# Altium schematic sheet 3.motor drivers.SchDoc
size A; DocumentNumber: 3; SheetNumber: 3; SheetTotal: 6
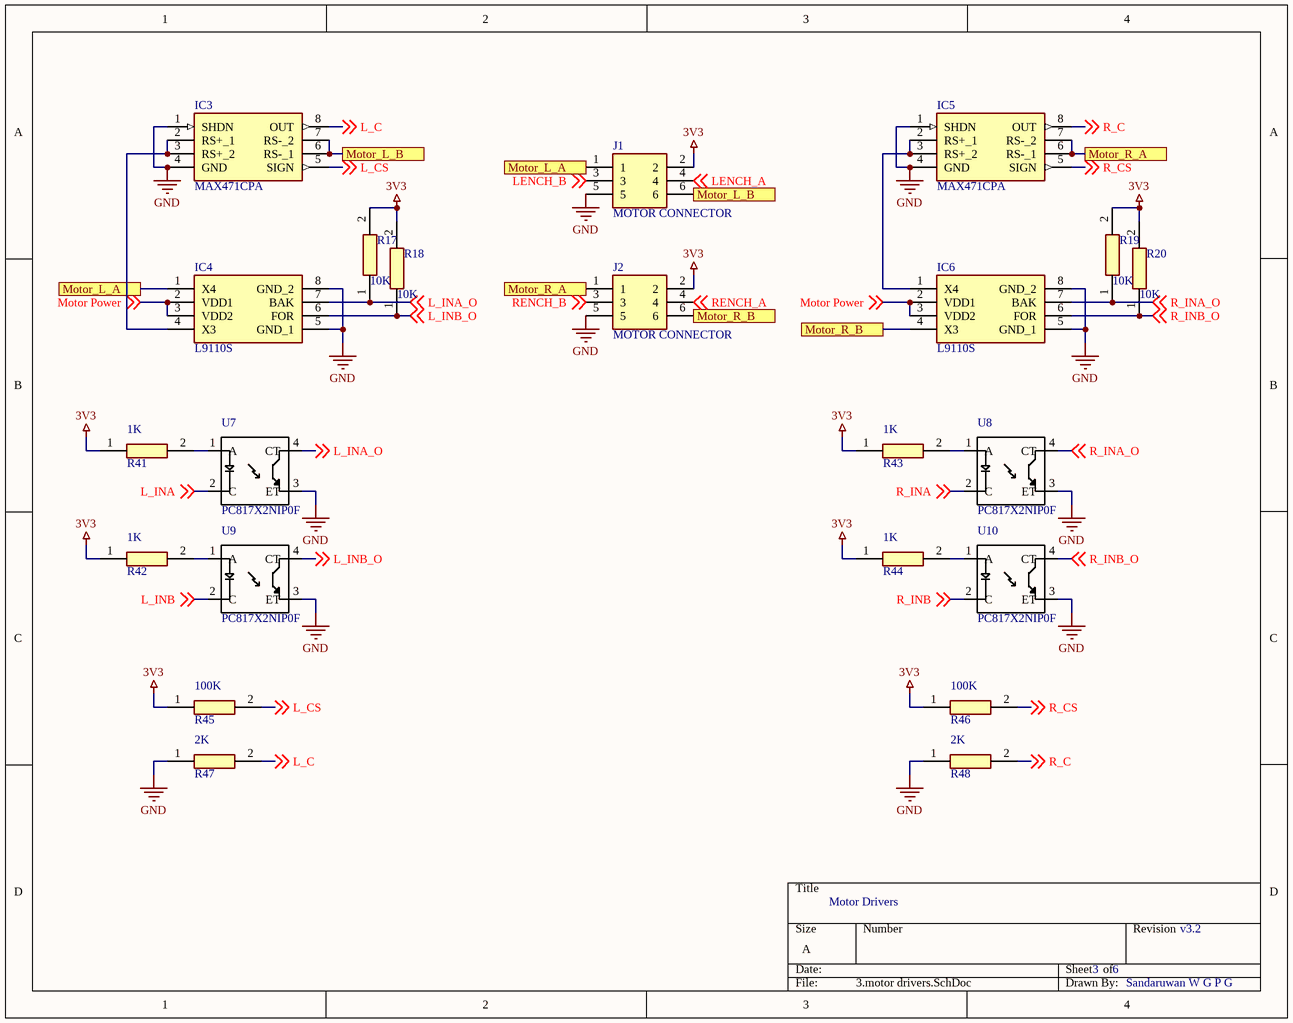
[diagram p0: 3.motor drivers.SchDoc]

## Parts
IC3  MAX471CPA  [SOIC127P600X175-8N]
IC4  L9110S  [SOIC127P600X175-8N]
IC5  MAX471CPA  [SOIC127P600X175-8N]
IC6  L9110S  [SOIC127P600X175-8N]
J1  MOTOR CONNECTOR  [533980671]
J2  MOTOR CONNECTOR  [533980671]
R17  value 10K  [RESC2012X65N]  (hidden comment: CPF0805B100KE)
R18  value 10K  [RESC2012X65N]  (hidden comment: CPF0805B100KE)
R19  value 10K  [RESC2012X65N]  (hidden comment: CPF0805B100KE)
R20  value 10K  [RESC2012X65N]  (hidden comment: CPF0805B100KE)
R41  value 1K  [RESC2012X65N]  (hidden comment: CPF0805)
R42  value 1K  [RESC2012X65N]  (hidden comment: CPF0805)
R43  value 1K  [RESC2012X65N]  (hidden comment: CPF0805)
R44  value 1K  [RESC2012X65N]  (hidden comment: CPF0805)
R45  value 100K  [RESC2012X65N]  (hidden comment: CPF0805)
R46  value 100K  [RESC2012X65N]  (hidden comment: CPF0805)
R47  value 2K  [RESC2012X65N]  (hidden comment: CPF0805)
R48  value 2K  [RESC2012X65N]  (hidden comment: CPF0805)
U7  PC817X2NIP0F  [*SOT254P975X400-4N]
U8  PC817X2NIP0F  [*SOT254P975X400-4N]
U9  PC817X2NIP0F  [*SOT254P975X400-4N]
U10  PC817X2NIP0F  [*SOT254P975X400-4N]

## Ports
Motor_L_A, Motor_L_B, Motor_R_A, Motor_R_B

## Nets
3V3: J1.2 J2.2 R17.2 R18.2 R19.2 R20.2 R41.1 R42.1 R43.1 R44.1 R45.1 R46.1
GND: IC3.1(SHDN) IC3.4(GND) IC4.5(GND_1) IC4.8(GND_2) IC5.1(SHDN) IC5.4(GND) IC6.5(GND_1) IC6.8(GND_2) J1.5 J2.5 R47.1 R48.1 U7.3(ET) U8.3(ET) U9.3(ET) U10.3(ET)
L_C: IC3.8(OUT) R47.2 ; off-sheet L_C
L_CS: IC3.5(SIGN) R45.2 ; off-sheet L_CS
L_INA: U7.2(C) ; off-sheet L_INA
L_INA_O: IC4.7(BAK) R17.1 U7.4(CT) ; off-sheet L_INA_O
L_INB: U9.2(C) ; off-sheet L_INB
L_INB_O: IC4.6(FOR) R18.1 U9.4(CT) ; off-sheet L_INB_O
LENCH_A: J1.4 ; off-sheet LENCH_A
LENCH_B: J1.3 ; off-sheet LENCH_B
Motor Power: IC4.2(VDD1) IC4.3(VDD2) IC6.2(VDD1) IC6.3(VDD2) ; off-sheet Motor Power
Motor_L_A: IC4.1(X4) J1.1 ; port Motor_L_A
Motor_L_B: IC3.6(RS-_1) IC3.7(RS-_2) J1.6 ; port Motor_L_B
Motor_R_A: IC5.6(RS-_1) IC5.7(RS-_2) J2.1 ; port Motor_R_A
Motor_R_B: IC6.4(X3) J2.6 ; port Motor_R_B
R_C: IC5.8(OUT) R48.2 ; off-sheet R_C
R_CS: IC5.5(SIGN) R46.2 ; off-sheet R_CS
R_INA: U8.2(C) ; off-sheet R_INA
R_INA_O: IC6.7(BAK) R19.1 U8.4(CT) ; off-sheet R_INA_O
R_INB: U10.2(C) ; off-sheet R_INB
R_INB_O: IC6.6(FOR) R20.1 U10.4(CT) ; off-sheet R_INB_O
RENCH_A: J2.4 ; off-sheet RENCH_A
RENCH_B: J2.3 ; off-sheet RENCH_B
NetIC3_2: IC3.2(RS+_1) IC3.3(RS+_2) IC4.4(X3)
NetIC5_2: IC5.2(RS+_1) IC5.3(RS+_2) IC6.1(X4)
NetR41_2: R41.2 U7.1(A)
NetR42_2: R42.2 U9.1(A)
NetR43_2: R43.2 U8.1(A)
NetR44_2: R44.2 U10.1(A)

## Notes on the sheet
- Motor Drivers
- v3.2
- Sandaruwan W G P G

## Library data of the parts
IC3 IC5 = MAX471CPA: Integrated Circuit; Manufacturer_Name: Maxim Integrated; Datasheet Link: https://pdfserv.maximintegrated.com/en/ds/MAX471-MAX472.pdf; Height: 1.75mm; Manufacturer_Part_Number: MAX471CPA; Mouser Part Number: 700-MAX471CPANR; Mouser Price/Stock: https://www.mouser.com/Search/Refine.aspx?Keyword=700-MAX471CPANR; RS Part Number: 0810352; RS Price/Stock: http://uk.rs-online.com/web/p/products/0810352
IC4 IC6 = L9110S: Integrated Circuit; Manufacturer_Name: Wuxi I-core Elec; Datasheet Link: https://datasheet.lcsc.com/szlcsc/Wuxi-Zhongwei-Aisin-Elec-L9110S_C85174.pdf; Height: 1.75mm; Manufacturer_Part_Number: L9110S
J1 J2 = 53398-0671: Connector; Manufacturer_Name: Molex; Allied_Number: 70090674; Datasheet Link: http://docs-emea.rs-online.com/webdocs/13c4/0900766b813c4502.pdf; Manufacturer_Part_Number: 53398-0671; Mouser Part Number: 538-53398-0671; Mouser Price/Stock: https://www.mouser.com/Search/Refine.aspx?Keyword=538-53398-0671; RS Part Number: 5427214P; RS Price/Stock: http://uk.rs-online.com/web/p/products/5427214P; Allied Price/Stock: http://www.alliedelec.com/molex-incorporated-53398-0671/70090674/
R17-R20 = CPF0805B100KE: Resistor; Manufacturer_Name: TE Connectivity; Allied_Number: 70286772; Datasheet Link: http://docs-europe.electrocomponents.com/webdocs/13d1/0900766b813d116f.pdf; Height: 0.65mm; Manufacturer_Part_Number: CPF0805B100KE; Mouser Part Number: 279-CPF0805B100KE; Mouser Price/Stock: https://www.mouser.com/Search/Refine.aspx?Keyword=279-CPF0805B100KE; RS Part Number: 6662673; RS Price/Stock: https://uk.rs-online.com/web/p/products/6662673; Allied Price/Stock: https://www.alliedelec.com/te-connectivity-cpf0805b100ke/70286772/
R41-R48 = CPF0805: Resistor; Manufacturer_Name: TE Connectivity; Manufacturer_Part_Number: CPF0805B100KE; Allied_Number: 70286772; Datasheet Link: http://docs-europe.electrocomponents.com/webdocs/13d1/0900766b813d116f.pdf; Height: 0.65mm; Mouser Part Number: 279-CPF0805B100KE; Mouser Price/Stock: https://www.mouser.com/Search/Refine.aspx?Keyword=279-CPF0805B100KE; RS Part Number: 6662673; RS Price/Stock: https://uk.rs-online.com/web/p/products/6662673; Allied Price/Stock: https://www.alliedelec.com/te-connectivity-cpf0805b100ke/70286772/
U7-U10 = PC817X2NIP0F: Optocoupler DC-IN 1-CH Transistor DC-OUT 4-Pin PDIP SMD; MF: Sharp Microelectronics; Package: SMD-4 Sharp; Price: None; SnapEDA_Link: https://www.snapeda.com/parts/PC817X2NIP0F/Sharp%20Microelectronics/view-part/?ref=snap; MP: PC817X2NIP0F; Availability: Unavailable; Value: *